# Altium schematic sheet Sheet1.SchDoc
size A4; SheetNumber: 1; SheetTotal: 1
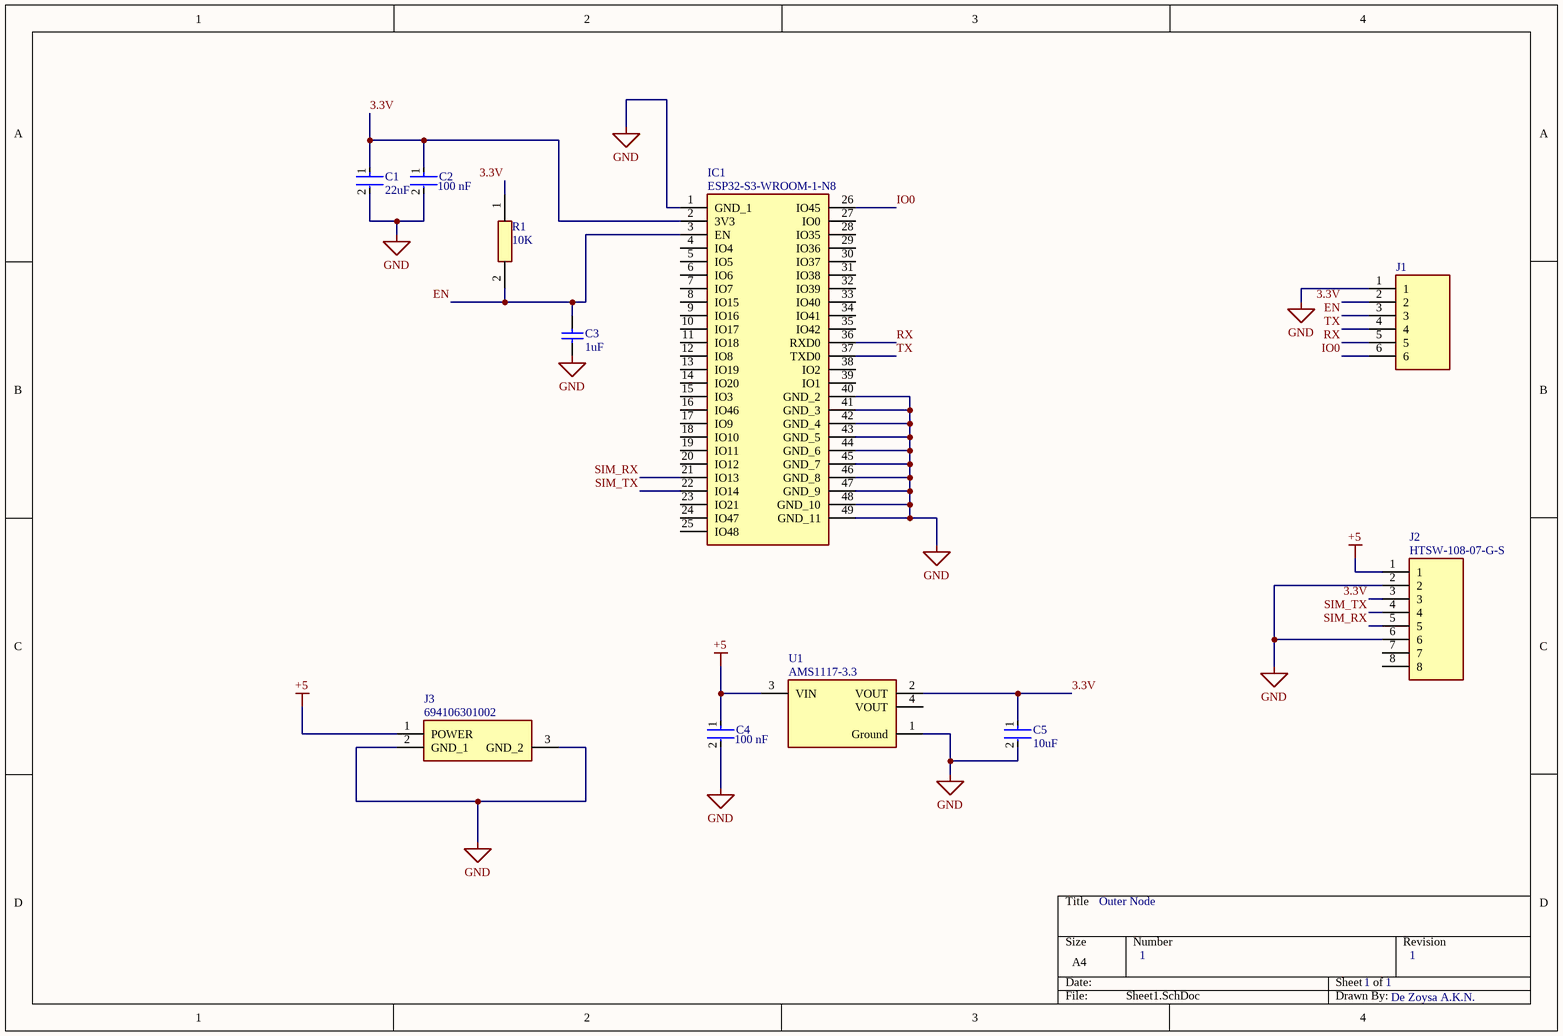
[diagram p0: Sheet1.SchDoc]

## Parts
C1  22uF  [FP-CL21-IPC_C]
C2  Capacitance: 100 nF  [FP-CC0805-0_85-MFG]  (hidden comment: CC0805KRX7R7BB104)
C3  1uF  [CAPC2013X140X50LL20T25]
C4  Capacitance: 100 nF  [FP-CC0805-0_85-MFG]  (hidden comment: CC0805KRX7R7BB104)
C5  10uF  [FP-CL21-IPC_B]
IC1  ESP32-S3-WROOM-1-N8  [ESP32S3WROOM1N8R2]
J1  22-28-4060  [HDRV6W66P0X254_1X6_1524X249X838P]  (value not drawn)
J2  HTSW-108-07-G-S  [HDRV8W64P0X254_1X8_2032X248X838P]
J3  694106301002  [694106301002_1]
R1  10K  [RESC2012X60N]
U1  AMS1117-3.3  [FP-AMS1117-IPC_C]

## Nets
+5: C4.1 J2.1 J3.1(POWER) U1.3(VIN)
GND: C1.2 C2.2 C3.1 C4.2 C5.2 IC1.1(GND_1) IC1.40(GND_2) IC1.41(GND_3) IC1.42(GND_4) IC1.43(GND_5) IC1.44(GND_6) IC1.45(GND_7) IC1.46(GND_8) IC1.47(GND_9) IC1.48(GND_10) IC1.49(GND_11) J1.1 J2.2 J2.6 J3.2(GND_1) J3.3(GND_2) U1.1(Ground)
3.3V: C1.1 C2.1 C5.1 IC1.2(3V3) J1.2 J2.3 R1.1 U1.2(VOUT)
EN: C3.2 IC1.3(EN) J1.3 R1.2
IO0: IC1.26(IO45) J1.6
RX: IC1.36(RXD0) J1.5
SIM_RX: IC1.21(IO13) J2.5
SIM_TX: IC1.22(IO14) J2.4
TX: IC1.37(TXD0) J1.4

Not connected (* = marked no-connect by the designer): IC1 4(IO4) 5(IO5) 6(IO6) 7(IO7) 8(IO15) 9(IO16) 10(IO17) 11(IO18) 12(IO8) 13(IO19) 14(IO20) 15(IO3) 16(IO46) 17(IO9) 18(IO10) 19(IO11) 20(IO12) 23(IO21) 24(IO47) 25(IO48) 27(IO0) 28(IO35) 29(IO36) 30(IO37) 31(IO38) 32(IO39) 33(IO40) 34(IO41) 35(IO42) 38(IO2) 39(IO1); J2 7 8; U1 4(VOUT)

## Notes on the sheet
- Outer Node
- 1
- De Zoysa A.K.N.

## Library data of the parts
C1 = CMP-13271-002990-1: CL21 Series 0805 22uF 16V ±20% Tolerance X5R Multilayer Ceramic Chip Capacitor; Case Code (Imperial): 0805; Capacitance: 22uF; Max Operating Temperature: 85°C; Min Operating Temperature: -55°C; Packaging: Tape and Reel; Case Code (Metric): 2012; Case/Package: 0805; Mount: Surface Mount; Tolerance: 20%; Thickness: 0.037inch; Voltage Rating: 16V; Width: 0.049inch; Length: 0.079inch
C2 C4 = CMP-1036-04402-6: CAP CER 0.1UF 16V X7R 0805; Manufacturer: Yageo; Material: Ceramic; Tolerance: 0.1; Value: 100 nF; Manufacturer Part Number: CC0805KRX7R7BB104; Temperature: -30°C to +85°C; Lead Free: Yes; Footprint Url: http://www.yageo.com/exep/pages/download/literatures/UPY-C_GEN_24.pdf; Voltage Rating: 16 V; Package: CC0805-0.85; RoHS: TRUE; Digikey Description: CAP CER 0.1UF 16V X7R 0805; Category: Cap; Octopart: https://octopart.com/cc0805krx7r7bb104-yageo-39467769; Device Class L3: Ceramic Capacitors; ComponentLink2URL: http://www.yageo.com/documents/recent/UPY-GPHC_Y5V_6.3V-to-50V_8.pdf; Temperature Range Low: -30°C; Mouser Description: Multilayer Ceramic Capacitors MLCC - SMD/SMT 100nF 16V X7R 10%; Automotive: No; Device Class L2: Capacitors; Height: 0.95mm; ComponentLink2Description: Datasheet; Temperature Characteristic: X7R; Ipc Land Pattern Name: CAPC200125X85; Device Class L1: Passive Components; Temperature Range High: +85°C
C3 = CMP-2007-04674-1: Part Number: 0805ZC105KAZ2A; Manufacturer: AVX Interconnect / Elco
C5 = CMP-2000-06102-2: CL21 Series 0805 10uF 16V ±10% Tolerance X5R Multilayer Ceramic Chip Capacitor; Dielectric: X7R; Length: 2mm; Depth: 1.25mm; Voltage: 16V; Width: 0.049inch; Capacitance: 10uF; Lead Free: Lead Free; Max Operating Temperature: 85°C; Mount: Surface Mount; Voltage Rating: 16V; Height: 1.25mm; Radiation Hardening: No; Packaging: Tape and Reel; Voltage Rating (DC): 16V; Thickness: 0.055inch; Case/Package: 0805; Case Code (Imperial): 0805; Min Operating Temperature: -55°C; Case Code (Metric): 2012; Package Quantity: 1; Tolerance: 10%
IC1 = ESP32-S3-WROOM-1-N8: Integrated Circuit; Manufacturer_Name: Espressif Systems; Datasheet Link: https://www.espressif.com/sites/default/files/documentation/esp32-s3-wroom-1_wroom-1u_datasheet_en.pdf; Height: 3.25mm; Manufacturer_Part_Number: ESP32-S3-WROOM-1-N8; Mouser Part Number: 356-ESP32-S3WROOM1N8; Mouser Price/Stock: https://www.mouser.co.uk/ProductDetail/Espressif-Systems/ESP32-S3-WROOM-1-N8?qs=Wj%2FVkw3K%252BMC1mq0KGPvoSQ%3D%3D
J1 = 22-28-4060: Connector; Manufacturer_Name: Molex; Datasheet Link: https://www.molex.com/pdm_docs/sd/022284060_sd.pdf; Height: 8.38mm; Manufacturer_Part_Number: 22-28-4060; Mouser Part Number: 538-22-28-4060; Mouser Price/Stock: https://www.mouser.co.uk/ProductDetail/Molex/22-28-4060?qs=d9fIA1aNikSACgwI0d%252BTOw%3D%3D
J2 = HTSW-108-07-G-S: Connector; Manufacturer_Name: SAMTEC; Datasheet Link: https://componentsearchengine.com/Datasheets/2/HTSW-108-07-G-S.pdf; Height: 8.38mm; Manufacturer_Part_Number: HTSW-108-07-G-S; Mouser Part Number: 200-HTSW10807GS; Mouser Price/Stock: https://www.mouser.co.uk/ProductDetail/Samtec/HTSW-108-07-G-S?qs=0lQeLiL1qyb%2Fksz39zrYSQ%3D%3D; Arrow Part Number: HTSW-108-07-G-S; Arrow Price/Stock: https://www.arrow.com/en/products/htsw-108-07-g-s/samtec?region=nac
J3 = 694106301002: Connector; Manufacturer_Name: Wurth Elektronik; Datasheet Link: https://datasheet.datasheetarchive.com/originals/distributors/Datasheets_SAMA/1c153bd2ba42bb51bda59ee4cd9765cd.pdf; Manufacturer_Part_Number: 694106301002; Mouser Part Number: 710-694106301002; Mouser Price/Stock: https://www.mouser.co.uk/ProductDetail/Wurth-Elektronik/694106301002?qs=a9WhcLg8qCwOEkcI62k5mA%3D%3D
R1 = CMP0805AFX-1002ELF: Resistor; Manufacturer_Name: Bourns; Datasheet Link: https://ms.componentsearchengine.com/Datasheets/2/CMP0805AFX-1002ELF.pdf; Height: 0.6mm; Manufacturer_Part_Number: CMP0805AFX-1002ELF; Mouser Part Number: 652-CMP0805AFX-1002L; Mouser Price/Stock: https://www.mouser.co.uk/ProductDetail/Bourns/CMP0805AFX-1002ELF?qs=TiOZkKH1s2RdWJm6UffAxg%3D%3D; Arrow Part Number: CMP0805AFX-1002ELF; Arrow Price/Stock: https://www.arrow.com/en/products/cmp0805afx-1002elf/bourns?region=nac
U1 = CMP-209535-000001-1: LDO Voltage Regulators 1A, 3.3V; Manufacturer: Advanced Monolithic Systems; Dropout Voltage: 1.1V; Output Type: Fixed; Nominal Supply Current: 5mA; Max Power Dissipation: 1.2W; Max Supply Voltage: 15V; Number Of Outputs: 1; Standoff Height: 0.64mm; Max Junction Temp: +125°C; Height: 1.8mm; Package: AMS1117; Device Class L2: Power Management ICs; ComponentLink2Description: Datasheet; ComponentLink2URL: http://www.advanced-monolithic.com/pdf/ds1117.pdf; Category: IC; RoHS: TRUE; Automotive: No; Device Class L1: Integrated Circuits (ICs); Output Current: 1A; Device Class L3: Voltage Regulators - Linear; Temperature: -40°C to +125°C; Output Voltage: 3.3V; Manufacturer Part Number: AMS1117-3.3; Temperature Range Low: -40°C; Octopart: https://octopart.com/ams1117-3.3-advanced+monolithic+systems-25899300; Lead Free: Yes; Ipc Land Pattern Name: SOT229P700X180-4; Temperature Range High: +125°C